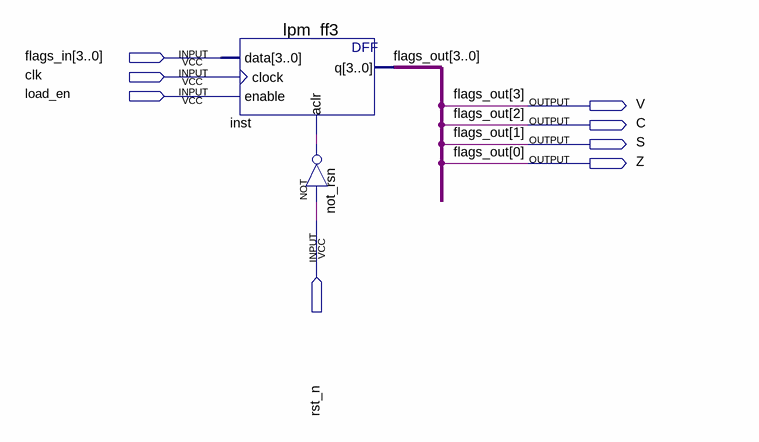
[diagram p0: schematic sheet]
// Quartus schematic fr_unit.bdf as structural Verilog: 2 symbols, 8 pins
module fr_unit (
  input  [3:0] flags_in,
  input  clk,
  input  load_en,
  input  rst_n,
  output V,
  output C,
  output S,
  output Z
);

  wire not_rsn_out;

  lpm_ff3 inst (.data(flags_in), .clock(clk), .enable(load_en), .aclr(not_rsn_out), .q({V, C, S, Z}));
  not not_rsn (not_rsn_out, rst_n);

  // Other names for the same wires on the sheet: flags_out[3:0] = {V, C, S, Z}
endmodule
